# Altium schematic sheet Microcode.SchDoc
size B; Author: E. Sims; Organization: Let's Build Rockets Inc.; SheetNumber: 10; SheetTotal: 17
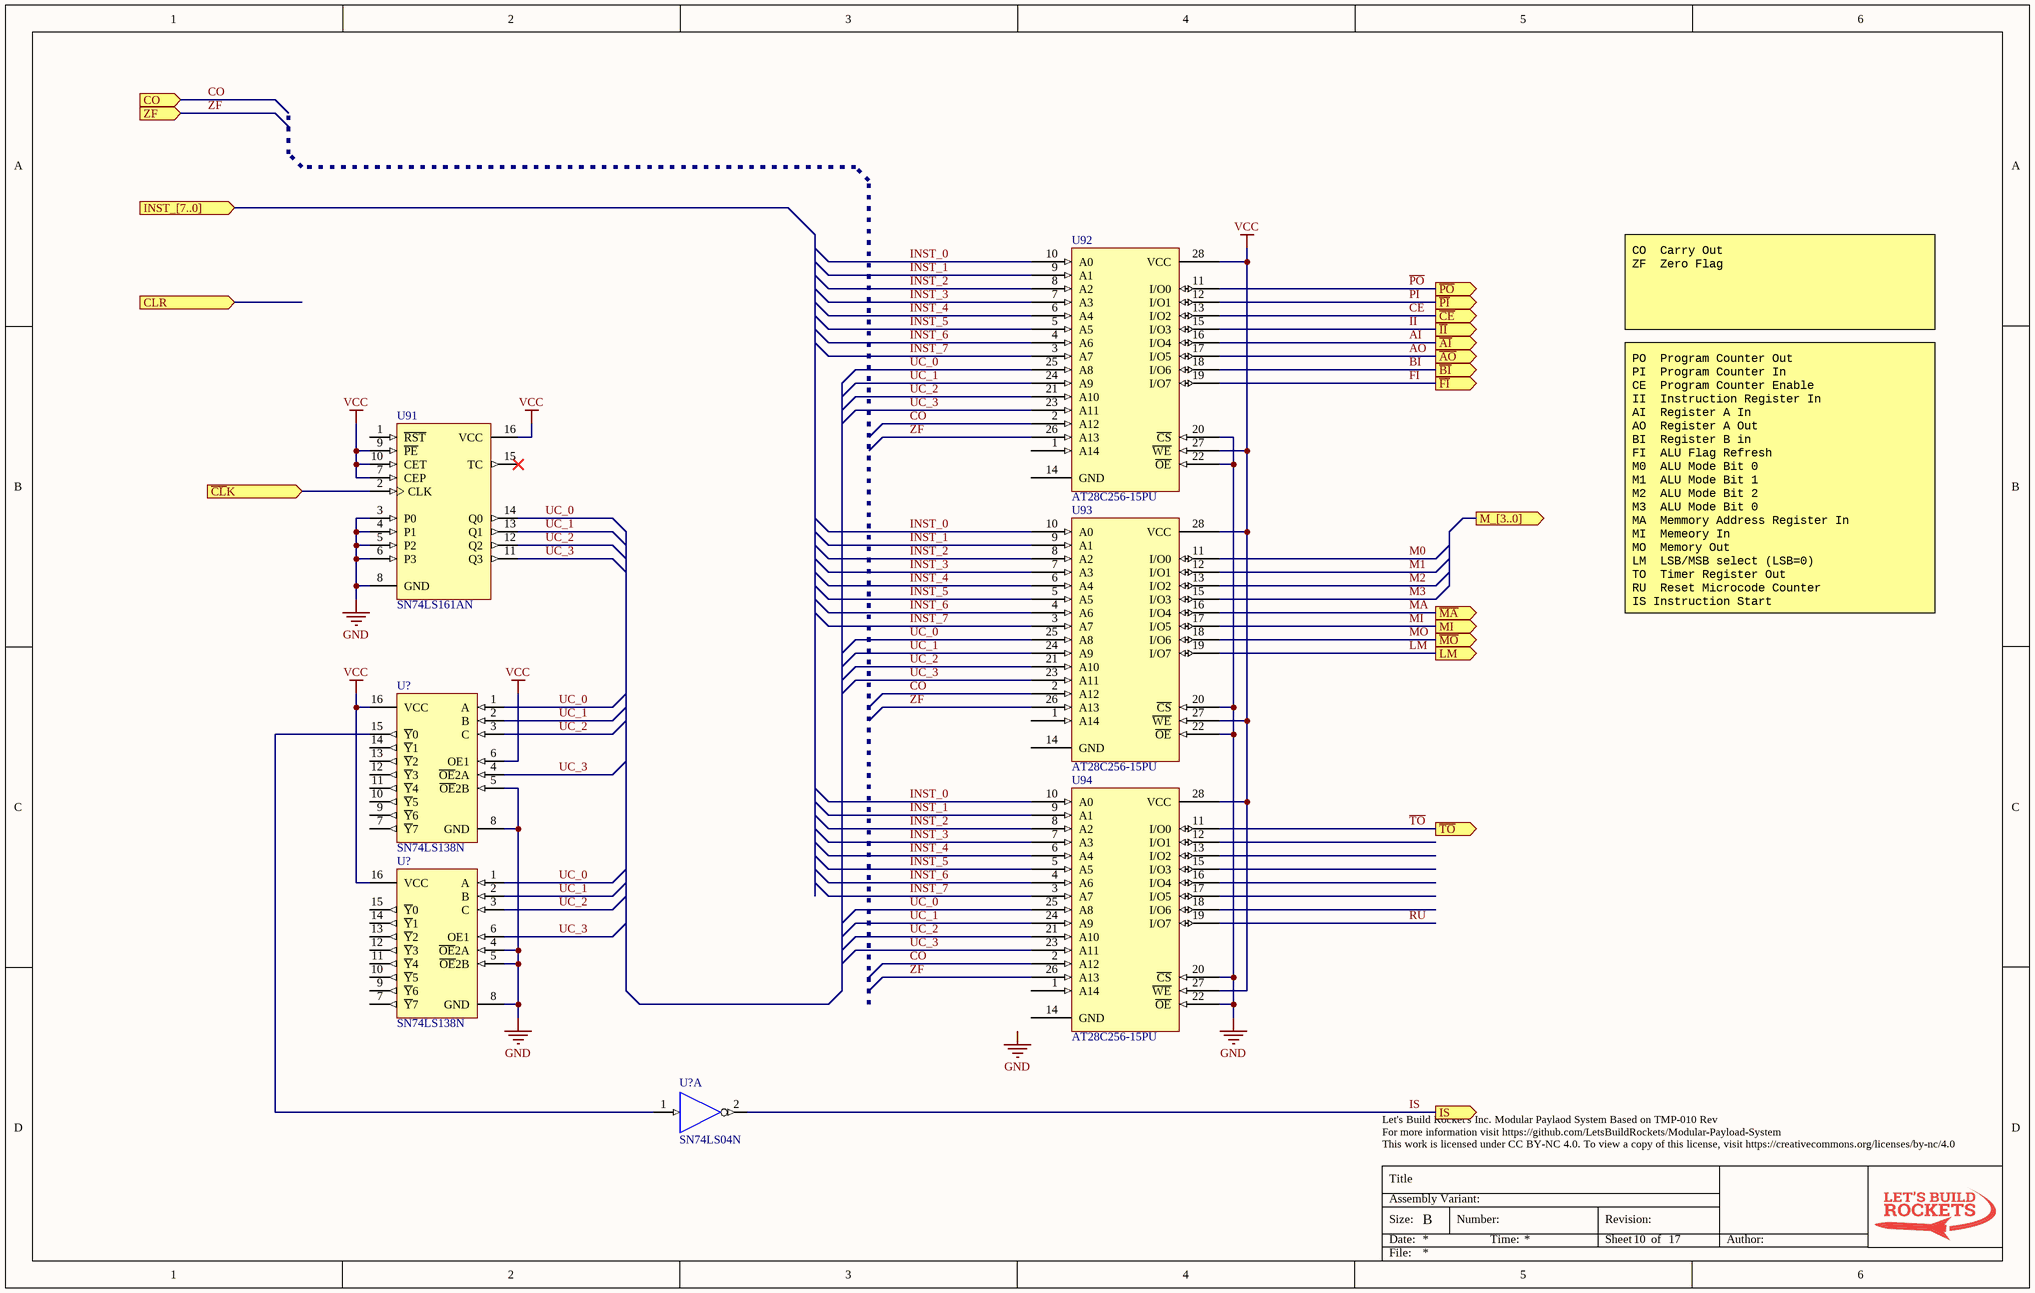
[diagram p0: Microcode.SchDoc]

## Parts
(Parts that share a designator on the sheet are numbered #1, #2 ... from top to bottom, then left to right.)
U91  SN74LS161AN  [N016]
U92  AT28C256-15PU  [J028]
U93  AT28C256-15PU  [J028]
U94  AT28C256-15PU  [J028]
U?#1  SN74LS138N  [N016]
U?#2  SN74LS138N  [N016]
U?#3  SN74LS04N  [N014]  (part A of 6)

## Ports
CLR (in), CO (in), INST_[7..0] (in), IS (out), LM (out), M_[3..0] (out), MI (out), ZF (in), ~{AI} (out), ~{AO} (out), ~{BI} (out), ~{CE} (out), ~{CL}K (in), ~{FI} (out), ~{II} (out), ~{MA} (out), ~{MO} (out), ~{PI} (out), ~{PO} (out), ~{TO} (out)

## Nets
GND: U91.3(P0) U91.4(P1) U91.5(P2) U91.6(P3) U91.8(GND) U92.20(~{CS}) U92.22(~{OE}) U93.20(~{CS}) U93.22(~{OE}) U94.20(~{CS}) U94.22(~{OE}) U?#1.5(~{OE}2B) U?#1.8(GND) U?#2.4(~{OE}2A) U?#2.5(~{OE}2B) U?#2.8(GND) U?#3.7(GND)
VCC: U91.7(CEP) U91.9(~{PE}) U91.10(CET) U91.16(VCC) U92.27(~{WE}) U92.28(VCC) U93.27(~{WE}) U93.28(VCC) U94.27(~{WE}) U94.28(VCC) U?#1.6(OE1) U?#1.16(VCC) U?#2.16(VCC) U?#3.14(VCC)
~{AI}: U92.16(I/O4) ; port ~{AI}
~{AO}: U92.17(I/O5) ; port ~{AO}
~{BI}: U92.18(I/O6) ; port ~{BI}
~{CE}: U92.13(I/O2) ; port ~{CE}
~{CL}K: U91.2(CLK) ; port ~{CL}K
CO: U92.2(A12) U93.2(A12) U94.2(A12) ; port CO
~{FI}: U92.19(I/O7) ; port ~{FI}
~{II}: U92.15(I/O3) ; port ~{II}
INST_0: U92.10(A0) U93.10(A0) U94.10(A0)
INST_1: U92.9(A1) U93.9(A1) U94.9(A1)
INST_2: U92.8(A2) U93.8(A2) U94.8(A2)
INST_3: U92.7(A3) U93.7(A3) U94.7(A3)
INST_4: U92.6(A4) U93.6(A4) U94.6(A4)
INST_5: U92.5(A5) U93.5(A5) U94.5(A5)
INST_6: U92.4(A6) U93.4(A6) U94.4(A6)
INST_7: U92.3(A7) U93.3(A7) U94.3(A7)
IS: U?#3.2(Y) ; port IS
LM: U93.19(I/O7) ; port LM
M0: U93.11(I/O0)
M1: U93.12(I/O1)
M2: U93.13(I/O2)
M3: U93.15(I/O3)
~{MA}: U93.16(I/O4) ; port ~{MA}
~{MO}: U93.18(I/O6) ; port ~{MO}
MI: U93.17(I/O5) ; port MI
~{PI}: U92.12(I/O1) ; port ~{PI}
~{PO}: U92.11(I/O0) ; port ~{PO}
RU: U94.19(I/O7)
~{TO}: U94.11(I/O0) ; port ~{TO}
UC_0: U91.14(Q0) U92.25(A8) U93.25(A8) U94.25(A8) U?#1.1(A) U?#2.1(A)
UC_1: U91.13(Q1) U92.24(A9) U93.24(A9) U94.24(A9) U?#1.2(B) U?#2.2(B)
UC_2: U91.12(Q2) U92.21(A10) U93.21(A10) U94.21(A10) U?#1.3(C) U?#2.3(C)
UC_3: U91.11(Q3) U92.23(A11) U93.23(A11) U94.23(A11) U?#1.4(~{OE}2A) U?#2.6(OE1)
ZF: U92.26(A13) U93.26(A13) U94.26(A13) ; port ZF
NetU?#1_15: U?#1.15(~{Y}0) U?#3.1(A)

Not connected (* = marked no-connect by the designer): U91 1(~{RST}) 15(TC)*; U92 1(A14) 14(GND); U93 1(A14) 14(GND); U94 1(A14) 12(I/O1) 13(I/O2) 14(GND) 15(I/O3) 16(I/O4) 17(I/O5) 18(I/O6); U?#1 7(~{Y}7) 9(~{Y}6) 10(~{Y}5) 11(~{Y}4) 12(~{Y}3) 13(~{Y}2) 14(~{Y}1); U?#2 7(~{Y}7) 9(~{Y}6) 10(~{Y}5) 11(~{Y}4) 12(~{Y}3) 13(~{Y}2) 14(~{Y}1) 15(~{Y}0)

## Notes on the sheet
- CO  Carry Out
  ZF  Zero Flag
- PO  Program Counter Out
  PI  Program Counter In
  CE  Program Counter Enable
  II  Instruction Register In
  AI  Register A In
  AO  Register A Out
  BI  Register B in
  FI  ALU Flag Refresh
  M0  ALU Mode Bit 0
  M1  ALU Mode Bit 1
  M2  ALU Mode Bit 2
  M3  ALU Mode Bit 0
  MA  Memmory Address Register In
  MI  Memeory In
  MO  Memory Out
  LM  LSB/MSB select (LSB=0)
  TO  Timer Register Out
  RU  Reset Microcode Counter
  IS Instruction Start
- Labels drawn without touching a wire or pin: GND
- Let's Build Rocket's Inc. Modular Paylaod System Based on TMP-010 Rev
  For more information visit https://github.com/LetsBuildRockets/Modular-Payload-System
  This work is licensed under CC BY-NC 4.0. To view a copy of this license, visit https://creativecommons.org/licenses/by-nc/4.0
- Title
- Size:
- Date:
- Assembly Variant:
- B
- Number:
- Time:
- Revision:
- Sheet
- of
- Author:
- File:

## Library data of the parts
U91 = SN74LS161AN: Synchronous 4-Bit Counter; Published: 8-Jun-2000; LatestRevisionDate: 04-Mar-2005; LatestRevisionNote: Stylized 3D Model Added.; DatasheetVersion: Mar-1988; PackageVersion: Oct-1995; PackageReference: N016; Publisher: Altium Limited; PackageDescription: DIP; 16 Leads; Row Spacing 7.62 mm; Pitch 2.54 mm; Code_JEDEC: MS-001-BB; ComponentLink1Description: Manufacturer Link; ComponentLink1URL: http://www.ti.com/; ComponentLink2Description: Datasheet; ComponentLink2URL: http://www-s.ti.com/sc/ds/sn74ls161a.pdf; ComponentLink3Description: URL Link1; ComponentLink3URL: http://focus.ti.com/docs/prod/folders/print/sn74ls161a.html
U?#1 U?#2 = SN74LS138N: 3-Line to 8-Line Decoder / Demultiplexer; Published: 8-Jun-2000; LatestRevisionDate: 04-Mar-2005; LatestRevisionNote: Stylized 3D Model Added.; DatasheetVersion: Mar-1988; PackageVersion: Oct-1995; PackageReference: N016; Publisher: Altium Limited; PackageDescription: DIP; 16 Leads; Row Spacing 7.62 mm; Pitch 2.54 mm; Code_JEDEC: MS-001-BB; ComponentLink1Description: Manufacturer Link; ComponentLink1URL: http://www.ti.com/; ComponentLink2Description: Datasheet; ComponentLink2URL: http://www-s.ti.com/sc/ds/sn74ls138.pdf
U?#3 = SN74LS04N: Hex Inverter; Published: 8-Jun-2000; LatestRevisionDate: 04-Mar-2005; LatestRevisionNote: Stylized 3D Model Added.; DatasheetVersion: Mar-1988; PackageVersion: Oct-1995; PackageReference: N014; Publisher: Altium Limited; PackageDescription: DIP; 14 Leads; Row Spacing 7.62 mm; Pitch 2.54 mm; ComponentLink1Description: Manufacturer Link; ComponentLink1URL: http://www.ti.com/; ComponentLink2Description: Datasheet; ComponentLink2URL: http://www-s.ti.com/sc/ds/sn74ls04.pdf